# Altium schematic sheet QCopterRC_POWER_Sch.SchDoc
size A4
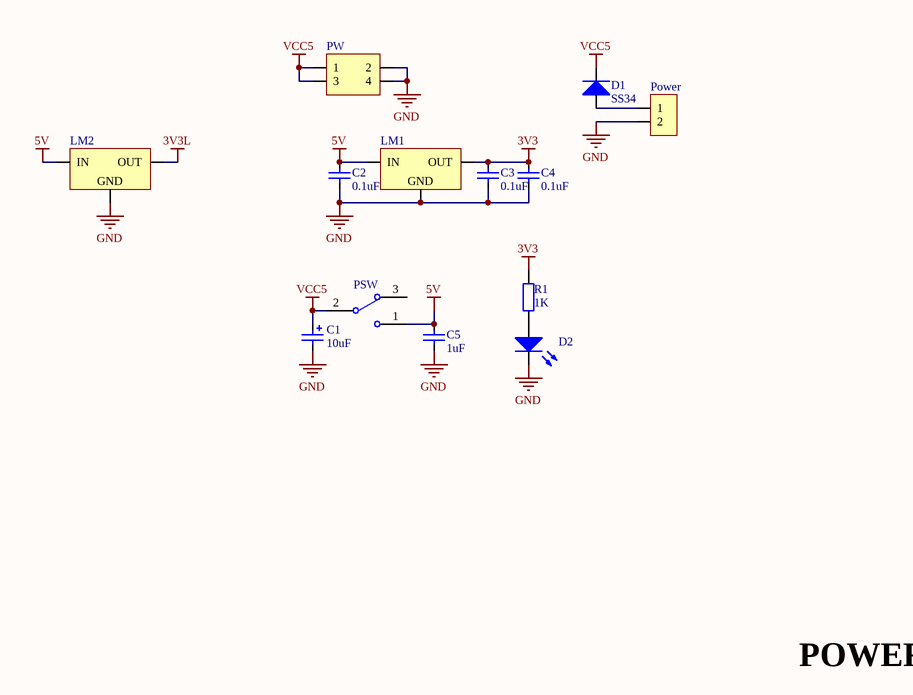
[diagram p0: QCopterRC_POWER_Sch.SchDoc]

## Parts
C1  value 10uF  [CAP_TAN_B1210]  (hidden comment: Cap_Tan_1210)
C2  value 0.1uF  [CAP_0603]  (hidden comment: Cap_0603)
C3  value 0.1uF  [CAP_0603]  (hidden comment: Cap_0603)
C4  value 0.1uF  [CAP_0603]  (hidden comment: Cap_0603)
C5  value 1uF  [CAP_0603]  (hidden comment: Cap_0603)
D1  SMA: SS34  [DO-214AC]  (hidden comment: Diode_SMA)
D2  LED_0603_WHITE  [LED_0603_WHITE]  (value not drawn)
LM1  LM1117  [SOT223]  (value not drawn)
LM2  LM1117  [SOT223]  (value not drawn)
Power  HDR1X2_90_2.54  [HDR1X2_90_2.54]  (value not drawn)
PSW  SW_SPDT_4.3X8.6_D90  [SW_SPDT_4.3X8.6_D90]  (value not drawn)
PW  HDR2X2_90_2.54  [HDR2X2_90_2.54]  (value not drawn)
R1  value 1K  [RES_0603]  (hidden comment: Res_0603)

## Nets
3V3: C3.2 C4.2 LM1.2(OUT) R1.2
3V3L: LM2.2(OUT)
5V: C2.1 C5.2 LM1.3(IN) LM2.3(IN) PSW.1
GND: C1.2 C2.2 C3.1 C4.1 C5.1 D2.2(K) LM1.1(GND) LM2.1(GND) Power.2 PW.2 PW.4
VCC5: C1.1 D1.2(K) PSW.2 PW.1 PW.3
NetD1_1: D1.1(A) Power.1
NetD2_1: D2.1(A) R1.1

Not connected (* = marked no-connect by the designer): PSW 3

## Notes on the sheet
- POWER

## Library data of the parts
C1 = Cap_Tan_1210: Capacitor
C2-C5 = Cap_0603: Capacitor
D1 = Diode_SMA: Diode
D2 = LED_0603_WHITE: LED
LM1 LM2 = LM1117: Power
Power = HDR1X2_90_2.54: Header
PSW = SW_SPDT_4.3X8.6_D90: Switch
PW = HDR2X2_90_2.54: Header
R1 = Res_0603: Resistor